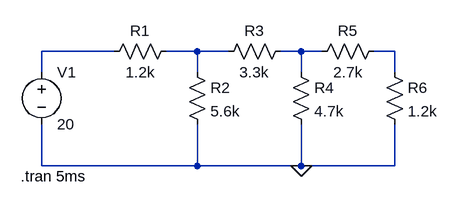
[diagram p0: schematic Draft4.asc]
Draft4.asc, the LTspice schematic file:
Version 4
SHEET 1 880 680
WIRE -672 128 -784 128
WIRE -544 128 -592 128
WIRE -496 128 -544 128
WIRE -384 128 -416 128
WIRE -352 128 -384 128
WIRE -240 128 -272 128
WIRE -784 160 -784 128
WIRE -544 160 -544 128
WIRE -384 160 -384 128
WIRE -240 160 -240 128
WIRE -784 304 -784 240
WIRE -544 304 -544 240
WIRE -544 304 -784 304
WIRE -384 304 -384 240
WIRE -384 304 -544 304
WIRE -240 304 -240 240
WIRE -240 304 -384 304
FLAG -384 304 0
SYMBOL voltage -784 144 R0
WINDOW 123 0 0 Left 0
WINDOW 39 0 0 Left 0
SYMATTR InstName V1
SYMATTR Value 20
SYMBOL res -576 112 R90
WINDOW 0 0 56 VBottom 2
WINDOW 3 32 56 VTop 2
SYMATTR InstName R1
SYMATTR Value 1.2k
SYMBOL res -560 144 R0
SYMATTR InstName R2
SYMATTR Value 5.6k
SYMBOL res -400 112 R90
WINDOW 0 0 56 VBottom 2
WINDOW 3 32 56 VTop 2
SYMATTR InstName R3
SYMATTR Value 3.3k
SYMBOL res -400 144 R0
SYMATTR InstName R4
SYMATTR Value 4.7k
SYMBOL res -256 112 R90
WINDOW 0 0 56 VBottom 2
WINDOW 3 32 56 VTop 2
SYMATTR InstName R5
SYMATTR Value 2.7k
SYMBOL res -256 144 R0
SYMATTR InstName R6
SYMATTR Value 1.2k
TEXT -816 320 Left 2 !.tran 5ms

The netlist it stands for:
* Draft4.asc
V1 N001 0 20
R1 N002 N001 1.2k
R2 N002 0 5.6k
R3 N003 N002 3.3k
R4 N003 0 4.7k
R5 N004 N003 2.7k
R6 N004 0 1.2k
.tran 5ms
.backanno
.end